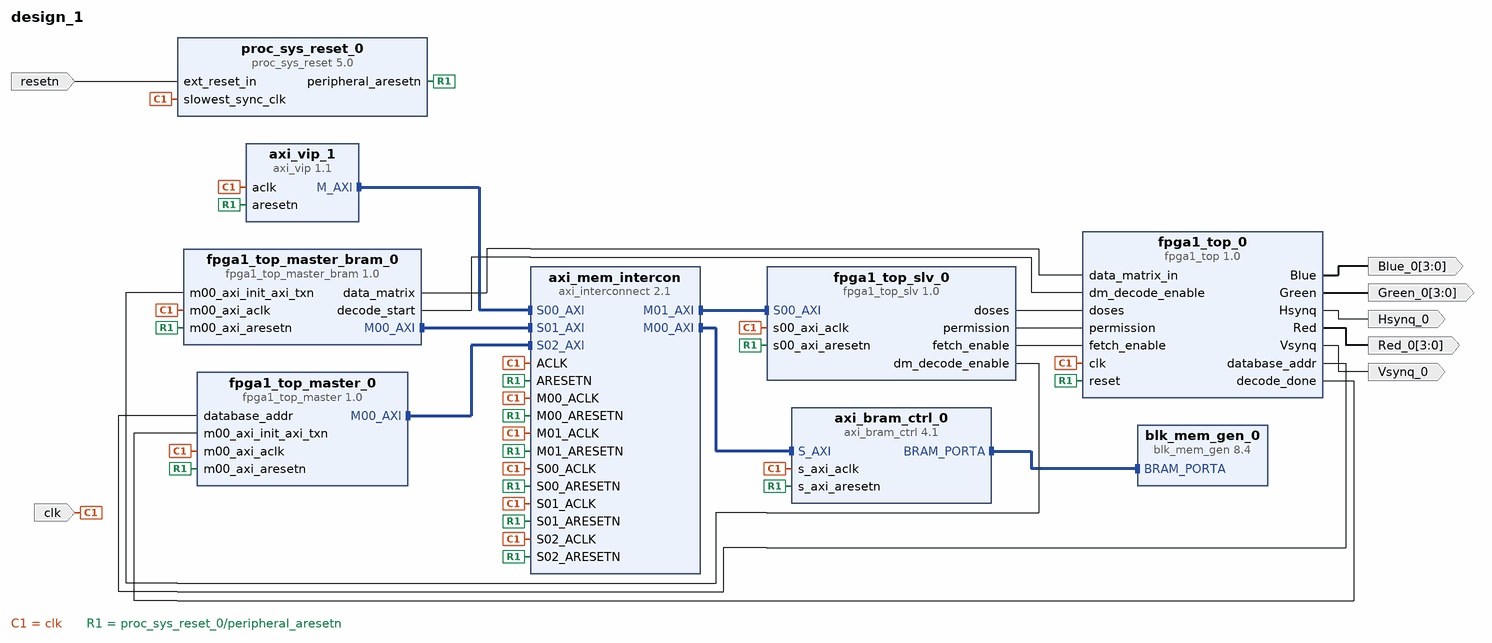
[diagram p0: block diagram of the top level]
# Vivado block design design_1, xc7a100tcsg324-1, Vivado 2018.3
create_bd_design design_1

create_bd_port -dir I -type clk clk
set_property -dict {CONFIG.FREQ_HZ 100000000} [get_bd_ports clk]
create_bd_port -dir I -type rst resetn
create_bd_port -dir O -from 3 -to 0 Red_0
create_bd_port -dir O -from 3 -to 0 Blue_0
create_bd_port -dir O Hsynq_0
create_bd_port -dir O -from 3 -to 0 Green_0
create_bd_port -dir O Vsynq_0

create_bd_cell -type ip -vlnv xilinx.com:ip:axi_vip:1.1 axi_vip_1
set_property -dict [list \
  CONFIG.ADDR_WIDTH 32 \
  CONFIG.DATA_WIDTH 32 \
  CONFIG.HAS_BRESP 1 \
  CONFIG.HAS_PROT 1 \
  CONFIG.HAS_RRESP 1 \
  CONFIG.HAS_WSTRB 1 \
  CONFIG.INTERFACE_MODE MASTER \
  CONFIG.PROTOCOL AXI4LITE \
  CONFIG.READ_WRITE_MODE READ_WRITE \
] [get_bd_cells axi_vip_1]
create_bd_cell -type ip -vlnv xilinx.com:ip:blk_mem_gen:8.4 blk_mem_gen_0
create_bd_cell -type ip -vlnv xilinx.com:ip:axi_bram_ctrl:4.1 axi_bram_ctrl_0
set_property -dict {CONFIG.PROTOCOL AXI4LITE CONFIG.SINGLE_PORT_BRAM 1} [get_bd_cells axi_bram_ctrl_0]
create_bd_cell -type ip -vlnv xilinx.com:ip:proc_sys_reset:5.0 proc_sys_reset_0
create_bd_cell -type ip -vlnv xilinx.com:user:fpga1_top_master:1.0 fpga1_top_master_0
set_property -dict [list \
  CONFIG.C_M00_AXI_TARGET_SLAVE_BASE_ADDR 0x44A00000 \
  CONFIG.C_M00_AXI_TRANSACTIONS_NUM 1 \
] [get_bd_cells fpga1_top_master_0]
create_bd_cell -type ip -vlnv xilinx.com:ip:axi_interconnect:2.1 axi_mem_intercon
set_property -dict {CONFIG.NUM_MI 2 CONFIG.NUM_SI 3} [get_bd_cells axi_mem_intercon]
create_bd_cell -type ip -vlnv xilinx.com:user:fpga1_top:1.0 fpga1_top_0
create_bd_cell -type ip -vlnv xilinx.com:user:fpga1_top_slv:1.0 fpga1_top_slv_0
create_bd_cell -type ip -vlnv xilinx.com:user:fpga1_top_master_bram:1.0 fpga1_top_master_bram_0
set_property -dict {CONFIG.C_M00_AXI_TRANSACTIONS_NUM 16} [get_bd_cells fpga1_top_master_bram_0]

# ---- connections ----

connect_bd_intf_net [get_bd_intf_pins fpga1_top_master_bram_0/M00_AXI] [get_bd_intf_pins axi_mem_intercon/S01_AXI]
connect_bd_intf_net [get_bd_intf_pins axi_mem_intercon/M00_AXI] [get_bd_intf_pins axi_bram_ctrl_0/S_AXI]
connect_bd_intf_net [get_bd_intf_pins axi_mem_intercon/M01_AXI] [get_bd_intf_pins fpga1_top_slv_0/S00_AXI]
connect_bd_intf_net [get_bd_intf_pins axi_vip_1/M_AXI] [get_bd_intf_pins axi_mem_intercon/S00_AXI]
connect_bd_intf_net [get_bd_intf_pins fpga1_top_master_0/M00_AXI] [get_bd_intf_pins axi_mem_intercon/S02_AXI]
connect_bd_intf_net [get_bd_intf_pins axi_bram_ctrl_0/BRAM_PORTA] [get_bd_intf_pins blk_mem_gen_0/BRAM_PORTA]
connect_bd_net [get_bd_ports clk] \
  [get_bd_pins axi_bram_ctrl_0/s_axi_aclk] [get_bd_pins axi_vip_1/aclk] [get_bd_pins proc_sys_reset_0/slowest_sync_clk] \
  [get_bd_pins axi_mem_intercon/ACLK] [get_bd_pins axi_mem_intercon/S00_ACLK] [get_bd_pins axi_mem_intercon/M00_ACLK] \
  [get_bd_pins axi_mem_intercon/M01_ACLK] [get_bd_pins axi_mem_intercon/S01_ACLK] \
  [get_bd_pins fpga1_top_master_0/m00_axi_aclk] [get_bd_pins axi_mem_intercon/S02_ACLK] [get_bd_pins fpga1_top_0/clk] \
  [get_bd_pins fpga1_top_slv_0/s00_axi_aclk] [get_bd_pins fpga1_top_master_bram_0/m00_axi_aclk]
connect_bd_net [get_bd_ports resetn] [get_bd_pins proc_sys_reset_0/ext_reset_in]
connect_bd_net [get_bd_pins proc_sys_reset_0/peripheral_aresetn] \
  [get_bd_pins axi_bram_ctrl_0/s_axi_aresetn] [get_bd_pins axi_vip_1/aresetn] [get_bd_pins axi_mem_intercon/S00_ARESETN] \
  [get_bd_pins axi_mem_intercon/M00_ARESETN] [get_bd_pins axi_mem_intercon/ARESETN] \
  [get_bd_pins axi_mem_intercon/M01_ARESETN] [get_bd_pins axi_mem_intercon/S01_ARESETN] \
  [get_bd_pins fpga1_top_master_0/m00_axi_aresetn] [get_bd_pins axi_mem_intercon/S02_ARESETN] [get_bd_pins fpga1_top_0/reset] \
  [get_bd_pins fpga1_top_slv_0/s00_axi_aresetn] [get_bd_pins fpga1_top_master_bram_0/m00_axi_aresetn]
connect_bd_net [get_bd_pins fpga1_top_0/database_addr] [get_bd_pins fpga1_top_master_0/database_addr]
connect_bd_net [get_bd_pins fpga1_top_0/Red] [get_bd_ports Red_0]
connect_bd_net [get_bd_pins fpga1_top_0/Blue] [get_bd_ports Blue_0]
connect_bd_net [get_bd_pins fpga1_top_0/Hsynq] [get_bd_ports Hsynq_0]
connect_bd_net [get_bd_pins fpga1_top_0/Green] [get_bd_ports Green_0]
connect_bd_net [get_bd_pins fpga1_top_0/Vsynq] [get_bd_ports Vsynq_0]
connect_bd_net [get_bd_pins fpga1_top_slv_0/doses] [get_bd_pins fpga1_top_0/doses]
connect_bd_net [get_bd_pins fpga1_top_slv_0/permission] [get_bd_pins fpga1_top_0/permission]
connect_bd_net [get_bd_pins fpga1_top_slv_0/fetch_enable] [get_bd_pins fpga1_top_0/fetch_enable]
connect_bd_net [get_bd_pins fpga1_top_master_bram_0/data_matrix] [get_bd_pins fpga1_top_0/data_matrix_in]
connect_bd_net [get_bd_pins fpga1_top_master_bram_0/decode_start] [get_bd_pins fpga1_top_0/dm_decode_enable]
connect_bd_net [get_bd_pins fpga1_top_slv_0/dm_decode_enable] [get_bd_pins fpga1_top_master_bram_0/m00_axi_init_axi_txn]
connect_bd_net [get_bd_pins fpga1_top_0/decode_done] [get_bd_pins fpga1_top_master_0/m00_axi_init_axi_txn]

# ---- address map ----
assign_bd_address -offset 0x40000000 -range 4K -target_address_space [get_bd_addr_spaces axi_vip_1/Master_AXI] [get_bd_addr_segs axi_bram_ctrl_0/S_AXI/Mem0]
assign_bd_address -offset 0x44A00000 -range 64K -target_address_space [get_bd_addr_spaces axi_vip_1/Master_AXI] [get_bd_addr_segs fpga1_top_slv_0/S00_AXI/S00_AXI_reg]
assign_bd_address -offset 0x40000000 -range 4K -target_address_space [get_bd_addr_spaces fpga1_top_master_0/M00_AXI] [get_bd_addr_segs axi_bram_ctrl_0/S_AXI/Mem0]
assign_bd_address -offset 0x44A00000 -range 64K -target_address_space [get_bd_addr_spaces fpga1_top_master_0/M00_AXI] [get_bd_addr_segs fpga1_top_slv_0/S00_AXI/S00_AXI_reg]
assign_bd_address -offset 0x40000000 -range 4K -target_address_space [get_bd_addr_spaces fpga1_top_master_bram_0/M00_AXI] [get_bd_addr_segs axi_bram_ctrl_0/S_AXI/Mem0]
assign_bd_address -offset 0x44A00000 -range 64K -target_address_space [get_bd_addr_spaces fpga1_top_master_bram_0/M00_AXI] [get_bd_addr_segs fpga1_top_slv_0/S00_AXI/S00_AXI_reg]

validate_bd_design
save_bd_design
